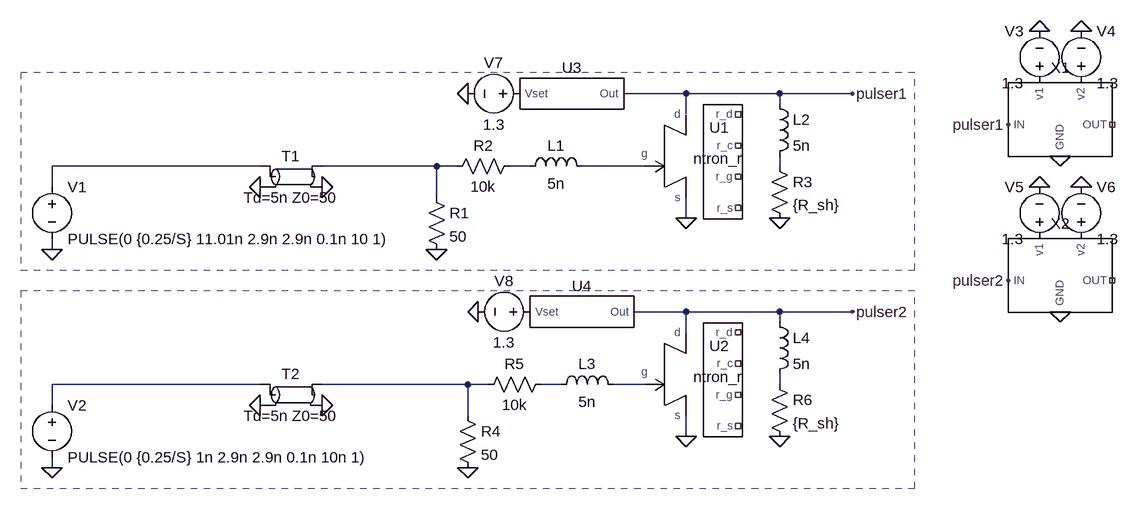
[diagram p0: schematic Draft2.asc]
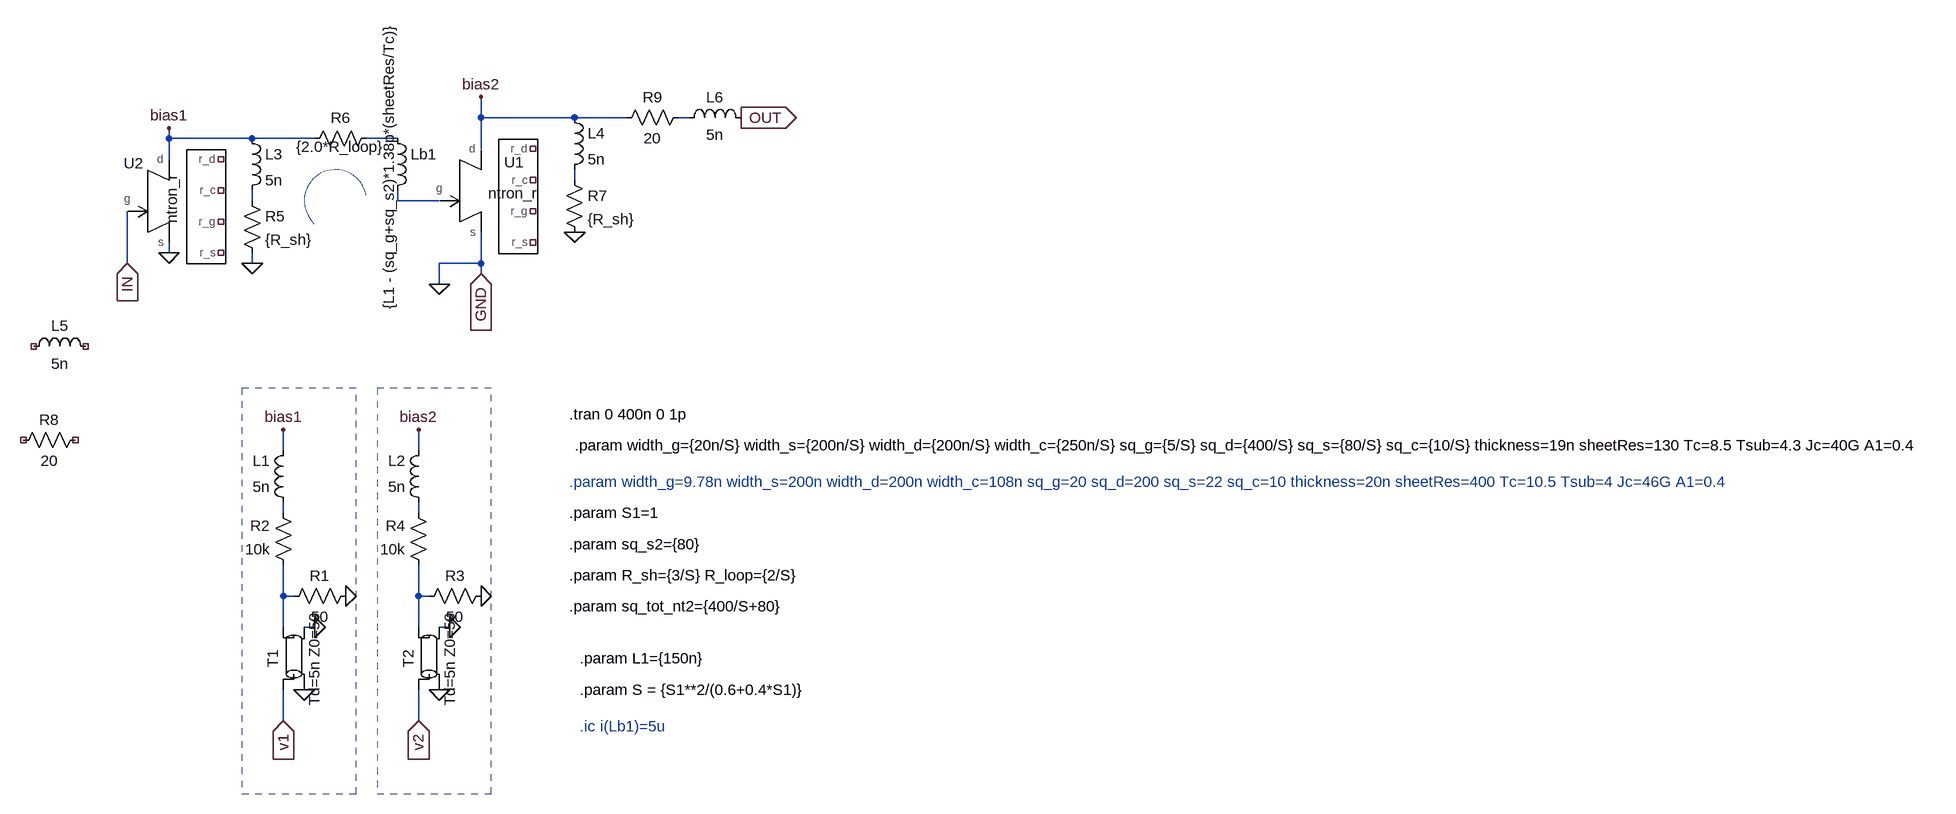
[diagram p1: sub-circuit snn_node.asc]
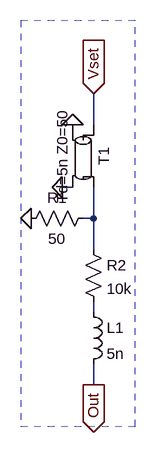
[diagram p2: sub-circuit nbias.asc]
Draft2.asc, the LTspice schematic file:
Version 4
SHEET 1 880 680
WIRE -448 -80 -544 -80
WIRE -304 -80 -448 -80
WIRE -192 -80 -304 -80
WIRE -304 -64 -304 -80
WIRE -448 -48 -448 -80
WIRE -1104 32 -1424 32
WIRE -832 32 -1008 32
WIRE -800 32 -832 32
WIRE -688 32 -720 32
WIRE -512 32 -608 32
WIRE -304 32 -304 16
WIRE -1424 64 -1424 32
WIRE -832 80 -832 32
WIRE -448 112 -448 80
WIRE -1424 160 -1424 144
WIRE -448 256 -528 256
WIRE -304 256 -448 256
WIRE -192 256 -304 256
WIRE -304 272 -304 256
WIRE -448 288 -448 256
WIRE -1104 368 -1424 368
WIRE -784 368 -1008 368
WIRE -752 368 -784 368
WIRE -640 368 -672 368
WIRE -512 368 -560 368
WIRE -304 368 -304 352
WIRE -1424 400 -1424 368
WIRE -784 416 -784 368
WIRE -448 448 -448 416
WIRE -1424 496 -1424 480
FLAG -832 160 0
FLAG -1424 160 0
FLAG -1008 64 0
FLAG -1104 64 0
FLAG -448 112 0
FLAG -304 112 0
FLAG -784 496 0
FLAG -1424 496 0
FLAG -1008 400 0
FLAG -1104 400 0
FLAG -448 448 0
FLAG -304 448 0
FLAG -192 -80 pulser1
FLAG -192 256 pulser2
FLAG 128 16 0
FLAG 128 256 0
FLAG 48 -32 pulser1
FLAG 48 208 pulser2
FLAG 96 64 0
FLAG 160 64 0
FLAG 96 -176 0
FLAG 160 -176 0
FLAG -784 -80 0
FLAG -768 256 0
SYMBOL SNN_node 128 -32 R0
SYMATTR InstName X1
SYMBOL SNN_node 128 208 R0
SYMATTR InstName X2
SYMBOL res -848 64 R0
SYMATTR InstName R1
SYMATTR Value 50
SYMBOL res -816 48 R270
WINDOW 0 32 56 VTop 2
WINDOW 3 0 56 VBottom 2
SYMATTR InstName R2
SYMATTR Value 10k
SYMBOL ind -704 48 R270
WINDOW 0 32 56 VTop 2
WINDOW 3 5 56 VBottom 2
SYMATTR InstName L1
SYMATTR Value 5n
SYMBOL voltage -1424 48 R0
WINDOW 123 0 0 Left 0
WINDOW 39 0 0 Left 0
SYMATTR InstName V1
SYMATTR Value PULSE(0 {0.25/S} 11.01n 2.9n 2.9n 0.1n 10 1)
SYMBOL tline -1056 48 R0
SYMATTR InstName T1
SYMATTR Value Td=5n Z0=50
SYMBOL res -320 16 R0
SYMATTR InstName R3
SYMATTR Value {R_sh}
SYMBOL ind -320 -80 R0
SYMATTR InstName L2
SYMATTR Value 5n
SYMBOL ntron_r -448 16 R0
WINDOW 39 2 131 Invisible 2
WINDOW 3 50 -11 Top 2
WINDOW 0 51 -28 Bottom 2
SYMATTR SpiceLine width_g={width_g} width_s={width_s} width_d={width_d} width_c={width_c} sq_g=10 sq_d={sq_d} sq_s={sq_s} sq_c={sq_c} thickness={thickness} sheetRes={sheetRes} Tc={Tc} Tsub={Tsub} Jc={Jc} A1={A1}
SYMATTR InstName U1
SYMBOL res -800 400 R0
SYMATTR InstName R4
SYMATTR Value 50
SYMBOL res -768 384 R270
WINDOW 0 32 56 VTop 2
WINDOW 3 0 56 VBottom 2
SYMATTR InstName R5
SYMATTR Value 10k
SYMBOL ind -656 384 R270
WINDOW 0 32 56 VTop 2
WINDOW 3 5 56 VBottom 2
SYMATTR InstName L3
SYMATTR Value 5n
SYMBOL voltage -1424 384 R0
WINDOW 123 0 0 Left 0
WINDOW 39 0 0 Left 0
SYMATTR InstName V2
SYMATTR Value PULSE(0 {0.25/S} 1n 2.9n 2.9n 0.1n 10n 1)
SYMBOL tline -1056 384 R0
SYMATTR InstName T2
SYMATTR Value Td=5n Z0=50
SYMBOL res -320 352 R0
SYMATTR InstName R6
SYMATTR Value {R_sh}
SYMBOL ind -320 256 R0
SYMATTR InstName L4
SYMATTR Value 5n
SYMBOL ntron_r -448 352 R0
WINDOW 39 2 131 Invisible 2
WINDOW 3 50 -11 Top 2
WINDOW 0 51 -28 Bottom 2
SYMATTR SpiceLine width_g={width_g} width_s={width_s} width_d={width_d} width_c={width_c} sq_g=10 sq_d={sq_d} sq_s={sq_s} sq_c={sq_c} thickness={thickness} sheetRes={sheetRes} Tc={Tc} Tsub={Tsub} Jc={Jc} A1={A1}
SYMATTR InstName U2
SYMBOL voltage 96 -80 R180
WINDOW 0 24 96 Left 2
WINDOW 3 24 16 Left 2
WINDOW 123 0 0 Left 0
WINDOW 39 0 0 Left 0
SYMATTR InstName V3
SYMATTR Value 1.3
SYMBOL voltage 160 -80 M180
WINDOW 0 24 96 Left 2
WINDOW 3 24 16 Left 2
WINDOW 123 0 0 Left 0
WINDOW 39 0 0 Left 0
SYMATTR InstName V4
SYMATTR Value 1.3
SYMBOL voltage 96 160 R180
WINDOW 0 24 96 Left 2
WINDOW 3 24 16 Left 2
WINDOW 123 0 0 Left 0
WINDOW 39 0 0 Left 0
SYMATTR InstName V5
SYMATTR Value 1.3
SYMBOL voltage 160 160 M180
WINDOW 0 24 96 Left 2
WINDOW 3 24 16 Left 2
WINDOW 123 0 0 Left 0
WINDOW 39 0 0 Left 0
SYMATTR InstName V6
SYMATTR Value 1.3
SYMBOL nBias -624 -80 R0
SYMATTR InstName U3
SYMBOL nBias -608 256 R0
SYMATTR InstName U4
SYMBOL voltage -688 -80 R90
WINDOW 0 -32 56 VBottom 2
WINDOW 3 32 56 VTop 2
WINDOW 123 0 0 Left 0
WINDOW 39 0 0 Left 0
SYMATTR InstName V7
SYMATTR Value 1.3
SYMBOL voltage -672 256 R90
WINDOW 0 -32 56 VBottom 2
WINDOW 3 32 56 VTop 2
WINDOW 123 0 0 Left 0
WINDOW 39 0 0 Left 0
SYMATTR InstName V8
SYMATTR Value 1.3
RECTANGLE Normal -1472 528 -96 224 2
RECTANGLE Normal -1472 192 -96 -112 2

snn_node.asc, the sub-circuit schematic file:
Version 4
SHEET 1 3192 1140
WIRE 640 96 640 64
WIRE 784 96 640 96
WIRE 864 96 784 96
WIRE 960 96 944 96
WIRE 160 128 160 112
WIRE 288 128 160 128
WIRE 384 128 288 128
WIRE 512 128 464 128
WIRE 640 144 640 96
WIRE 160 160 160 128
WIRE 784 192 784 176
WIRE 288 224 288 208
WIRE 512 224 512 208
WIRE 576 224 512 224
WIRE 160 304 160 288
WIRE 96 320 96 240
WIRE 288 320 288 304
WIRE 640 320 640 272
WIRE 640 320 576 320
WIRE 640 336 640 320
WIRE 576 352 576 320
WIRE 336 608 336 576
WIRE 544 608 544 576
WIRE 336 704 336 688
WIRE 544 704 544 688
WIRE 336 832 336 784
WIRE 352 832 336 832
WIRE 544 832 544 784
WIRE 560 832 544 832
WIRE 336 880 336 832
WIRE 384 880 368 880
WIRE 544 880 544 832
WIRE 592 880 576 880
WIRE 336 1024 336 976
WIRE 544 1024 544 976
FLAG 432 832 0
FLAG 368 976 0
FLAG 384 880 0
FLAG 336 576 bias1
FLAG 640 832 0
FLAG 576 976 0
FLAG 592 880 0
FLAG 544 576 bias2
FLAG 288 320 0
FLAG 160 304 0
FLAG 160 112 bias1
FLAG 640 64 bias2
FLAG 784 272 0
FLAG 336 1024 v1
IOPIN 336 1024 In
FLAG 544 1024 v2
IOPIN 544 1024 In
FLAG 96 320 IN
IOPIN 96 320 In
FLAG 640 336 GND
IOPIN 640 336 In
FLAG 576 352 0
FLAG 1040 96 OUT
IOPIN 1040 96 Out
SYMBOL tline 352 928 R270
SYMATTR InstName T1
SYMATTR Value Td=5n Z0=50
SYMBOL res 336 848 R270
WINDOW 0 32 56 VTop 2
WINDOW 3 0 56 VBottom 2
SYMATTR InstName R1
SYMATTR Value 50
SYMBOL res 352 800 R180
WINDOW 0 36 76 Left 2
WINDOW 3 36 40 Left 2
SYMATTR InstName R2
SYMATTR Value 10k
SYMBOL ind 352 704 R180
WINDOW 0 36 80 Left 2
WINDOW 3 36 40 Left 2
SYMATTR InstName L1
SYMATTR Value 5n
SYMBOL tline 560 928 R270
SYMATTR InstName T2
SYMATTR Value Td=5n Z0=50
SYMBOL res 544 848 R270
WINDOW 0 32 56 VTop 2
WINDOW 3 0 56 VBottom 2
SYMATTR InstName R3
SYMATTR Value 50
SYMBOL res 560 800 R180
WINDOW 0 36 76 Left 2
WINDOW 3 36 40 Left 2
SYMATTR InstName R4
SYMATTR Value 10k
SYMBOL ind 560 704 R180
WINDOW 0 36 80 Left 2
WINDOW 3 36 40 Left 2
SYMATTR InstName L2
SYMATTR Value 5n
SYMBOL ind 496 112 R0
WINDOW 3 2 -165 VRight 2
SYMATTR Value {L1 - (sq_g+sq_s2)*1.38p*(sheetRes/Tc)}
SYMATTR InstName Lb1
SYMBOL ntron_r 640 208 R0
WINDOW 39 2 131 Invisible 2
WINDOW 3 50 -11 Top 2
WINDOW 0 51 -28 Bottom 2
SYMATTR SpiceLine width_g={width_g} width_s={width_s} width_d={width_d} width_c={width_c} sq_g={sq_g} sq_d={sq_tot_nt2-sq_s2} sq_s={sq_s2} sq_c={sq_c} thickness={thickness} sheetRes={sheetRes} Tc={Tc} Tsub={Tsub} Jc={Jc} A1={A1}
SYMATTR InstName U1
SYMBOL res 272 208 R0
SYMATTR InstName R5
SYMATTR Value {R_sh}
SYMBOL ind 272 112 R0
SYMATTR InstName L3
SYMATTR Value 5n
SYMBOL res 368 144 R270
WINDOW 0 32 56 VTop 2
WINDOW 3 19 56 VBottom 2
SYMATTR InstName R6
SYMATTR Value {2.0*R_loop}
SYMBOL ntron_r 160 224 R0
WINDOW 39 2 131 Invisible 2
WINDOW 3 20 -4 VBottom 2
WINDOW 0 -54 -42 Bottom 2
SYMATTR SpiceLine width_g={width_g} width_s={width_s} width_d={width_d} width_c={width_c} sq_g=10 sq_d={sq_d} sq_s={sq_s} sq_c={sq_c} thickness={thickness} sheetRes={sheetRes} Tc={Tc} Tsub={Tsub} Jc={Jc} A1={A1}
SYMATTR InstName U2
SYMBOL ind 768 80 R0
SYMATTR InstName L4
SYMATTR Value 5n
SYMBOL res 768 176 R0
SYMATTR InstName R7
SYMATTR Value {R_sh}
SYMBOL ind 944 112 R270
WINDOW 0 32 56 VTop 2
WINDOW 3 5 56 VBottom 2
SYMATTR InstName L6
SYMATTR Value 5n
SYMBOL res 960 80 R90
WINDOW 0 0 56 VBottom 2
WINDOW 3 32 56 VTop 2
SYMATTR InstName R9
SYMATTR Value 20
SYMBOL ind -64 464 R270
WINDOW 0 32 56 VTop 2
WINDOW 3 5 56 VBottom 2
SYMATTR InstName L5
SYMATTR Value 5n
SYMBOL res 32 576 R90
WINDOW 0 0 56 VBottom 2
WINDOW 3 32 56 VTop 2
SYMATTR InstName R8
SYMATTR Value 20
TEXT 776 552 Left 2 !.tran 0 400n 0 1p
TEXT 792 1032 Left 2 ;.ic i(Lb1)=5u
TEXT 784 600 Left 2 !.param width_g={20n/S} width_s={200n/S} width_d={200n/S} width_c={250n/S} sq_g={5/S} sq_d={400/S} sq_s={80/S} sq_c={10/S} thickness=19n sheetRes=130 Tc=8.5 Tsub=4.3 Jc=40G A1=0.4
TEXT 776 800 Left 2 !.param R_sh={3/S} R_loop={2/S}
TEXT 776 656 Left 2 ;.param width_g=9.78n width_s=200n width_d=200n width_c=108n sq_g=20 sq_d=200 sq_s=22 sq_c=10 thickness=20n sheetRes=400 Tc=10.5 Tsub=4 Jc=46G A1=0.4
TEXT 776 752 Left 2 !.param sq_s2={80}
TEXT 776 848 Left 2 !.param sq_tot_nt2={400/S+80}
TEXT 792 928 Left 2 !.param L1={150n}
TEXT 776 704 Left 2 !.param S1=1
TEXT 792 976 Left 2 !.param S = {S1**2/(0.6+0.4*S1)}
RECTANGLE Normal 448 512 272 1136 2
RECTANGLE Normal 656 512 480 1136 2
ARC Normal 368 272 464 176 485 211 381 261 2

nbias.asc, the sub-circuit schematic file:
Version 4
SHEET 1 880 680
WIRE 80 -96 80 -144
WIRE 48 0 32 0
WIRE 80 48 80 0
WIRE 80 48 64 48
WIRE 80 96 80 48
WIRE 80 192 80 176
WIRE 80 304 80 272
FLAG -16 48 0
FLAG 48 -96 0
FLAG 32 0 0
FLAG 80 304 Out
IOPIN 80 304 Out
FLAG 80 -144 Vset
IOPIN 80 -144 In
SYMBOL tline 64 -48 R90
SYMATTR InstName T1
SYMATTR Value Td=5n Z0=50
SYMBOL res 80 32 R90
WINDOW 0 0 56 VBottom 2
WINDOW 3 32 56 VTop 2
SYMATTR InstName R1
SYMATTR Value 50
SYMBOL res 64 80 R0
SYMATTR InstName R2
SYMATTR Value 10k
SYMBOL ind 64 176 R0
SYMATTR InstName L1
SYMATTR Value 5n
RECTANGLE Normal -32 368 144 -256 2

The netlist it stands for:
* Draft2.asc
XX1 0 pulser1 P001 P002 NC_01 snn_node
XX2 0 pulser2 P003 P004 NC_02 snn_node
R1 N002 0 50
R2 N002 N003 10k
L1 N003 N004 5n
V1 N001 0 PULSE(0 {0.25/S} 11.01n 2.9n 2.9n 0.1n 10 1)
T1 N001 0 N002 0 Td=5n Z0=50
R3 N005 0 {R_sh}
L2 pulser1 N005 5n
XU1 N004 pulser1 0 NC_03 NC_04 NC_05 NC_06 ntron_r ntron_r width_g={width_g} width_s={width_s} width_d={width_d} width_c={width_c} sq_g=10 sq_d={sq_d} sq_s={sq_s} sq_c={sq_c} thickness={thickness} sheetRes={sheetRes} Tc={Tc} Tsub={Tsub} Jc={Jc} A1={A1}  ; pins g d s r_g r_d r_c r_s
R4 N007 0 50
R5 N007 N008 10k
L3 N008 N009 5n
V2 N006 0 PULSE(0 {0.25/S} 1n 2.9n 2.9n 0.1n 10n 1)
T2 N006 0 N007 0 Td=5n Z0=50
R6 N010 0 {R_sh}
L4 pulser2 N010 5n
XU2 N009 pulser2 0 NC_07 NC_08 NC_09 NC_10 ntron_r ntron_r width_g={width_g} width_s={width_s} width_d={width_d} width_c={width_c} sq_g=10 sq_d={sq_d} sq_s={sq_s} sq_c={sq_c} thickness={thickness} sheetRes={sheetRes} Tc={Tc} Tsub={Tsub} Jc={Jc} A1={A1}  ; pins g d s r_g r_d r_c r_s
V3 P001 0 1.3
V4 P002 0 1.3
V5 P003 0 1.3
V6 P004 0 1.3
XU3 P005 pulser1 nbias
XU4 P006 pulser2 nbias
V7 P005 0 1.3
V8 P006 0 1.3

* block symbol definitions
.subckt snn_node GND IN v1 v2 OUT
T1 v1 0 N008 0 Td=5n Z0=50
R1 N008 0 50
R2 N008 N006 10k
L1 N006 bias1 5n
T2 v2 0 N009 0 Td=5n Z0=50
R3 N009 0 50
R4 N009 N007 10k
L2 N007 bias2 5n
Lb1 N002 N005 {L1 - (sq_g+sq_s2)*1.38p*(sheetRes/Tc)}
XU1 N005 bias2 0 NC_01 NC_02 NC_03 NC_04 ntron_r ntron_r width_g={width_g} width_s={width_s} width_d={width_d} width_c={width_c} sq_g={sq_g} sq_d={sq_tot_nt2-sq_s2} sq_s={sq_s2} sq_c={sq_c} thickness={thickness} sheetRes={sheetRes} Tc={Tc} Tsub={Tsub} Jc={Jc} A1={A1}  ; pins g d s r_g r_d r_c r_s
R5 N004 0 {R_sh}
L3 bias1 N004 5n
R6 bias1 N002 {2.0*R_loop}
XU2 IN bias1 0 NC_05 NC_06 NC_07 NC_08 ntron_r ntron_r width_g={width_g} width_s={width_s} width_d={width_d} width_c={width_c} sq_g=10 sq_d={sq_d} sq_s={sq_s} sq_c={sq_c} thickness={thickness} sheetRes={sheetRes} Tc={Tc} Tsub={Tsub} Jc={Jc} A1={A1}  ; pins g d s r_g r_d r_c r_s
L4 bias2 N003 5n
R7 N003 0 {R_sh}
L6 N001 OUT 5n
R9 N001 bias2 20
L5 NC_09 NC_10 5n
R8 NC_11 NC_12 20
.tran 0 400n 0 1p
* .ic i(Lb1)=5u
.param width_g={20n/S} width_s={200n/S} width_d={200n/S} width_c={250n/S} sq_g={5/S} sq_d={400/S} sq_s={80/S} sq_c={10/S} thickness=19n sheetRes=130 Tc=8.5 Tsub=4.3 Jc=40G A1=0.4
.param R_sh={3/S} R_loop={2/S}
* .param width_g=9.78n width_s=200n width_d=200n width_c=108n sq_g=20 sq_d=200 sq_s=22 sq_c=10 thickness=20n sheetRes=400 Tc=10.5 Tsub=4 Jc=46G A1=0.4
.param sq_s2={80}
.param sq_tot_nt2={400/S+80}
.param L1={150n}
.param S1=1
.param S = {S1**2/(0.6+0.4*S1)}
.ends snn_node

.subckt nbias Vset Out
T1 Vset 0 N001 0 Td=5n Z0=50
R1 N001 0 50
R2 N001 N002 10k
L1 N002 Out 5n
.ends nbias

.lib ntron_2.lib
.backanno
.end